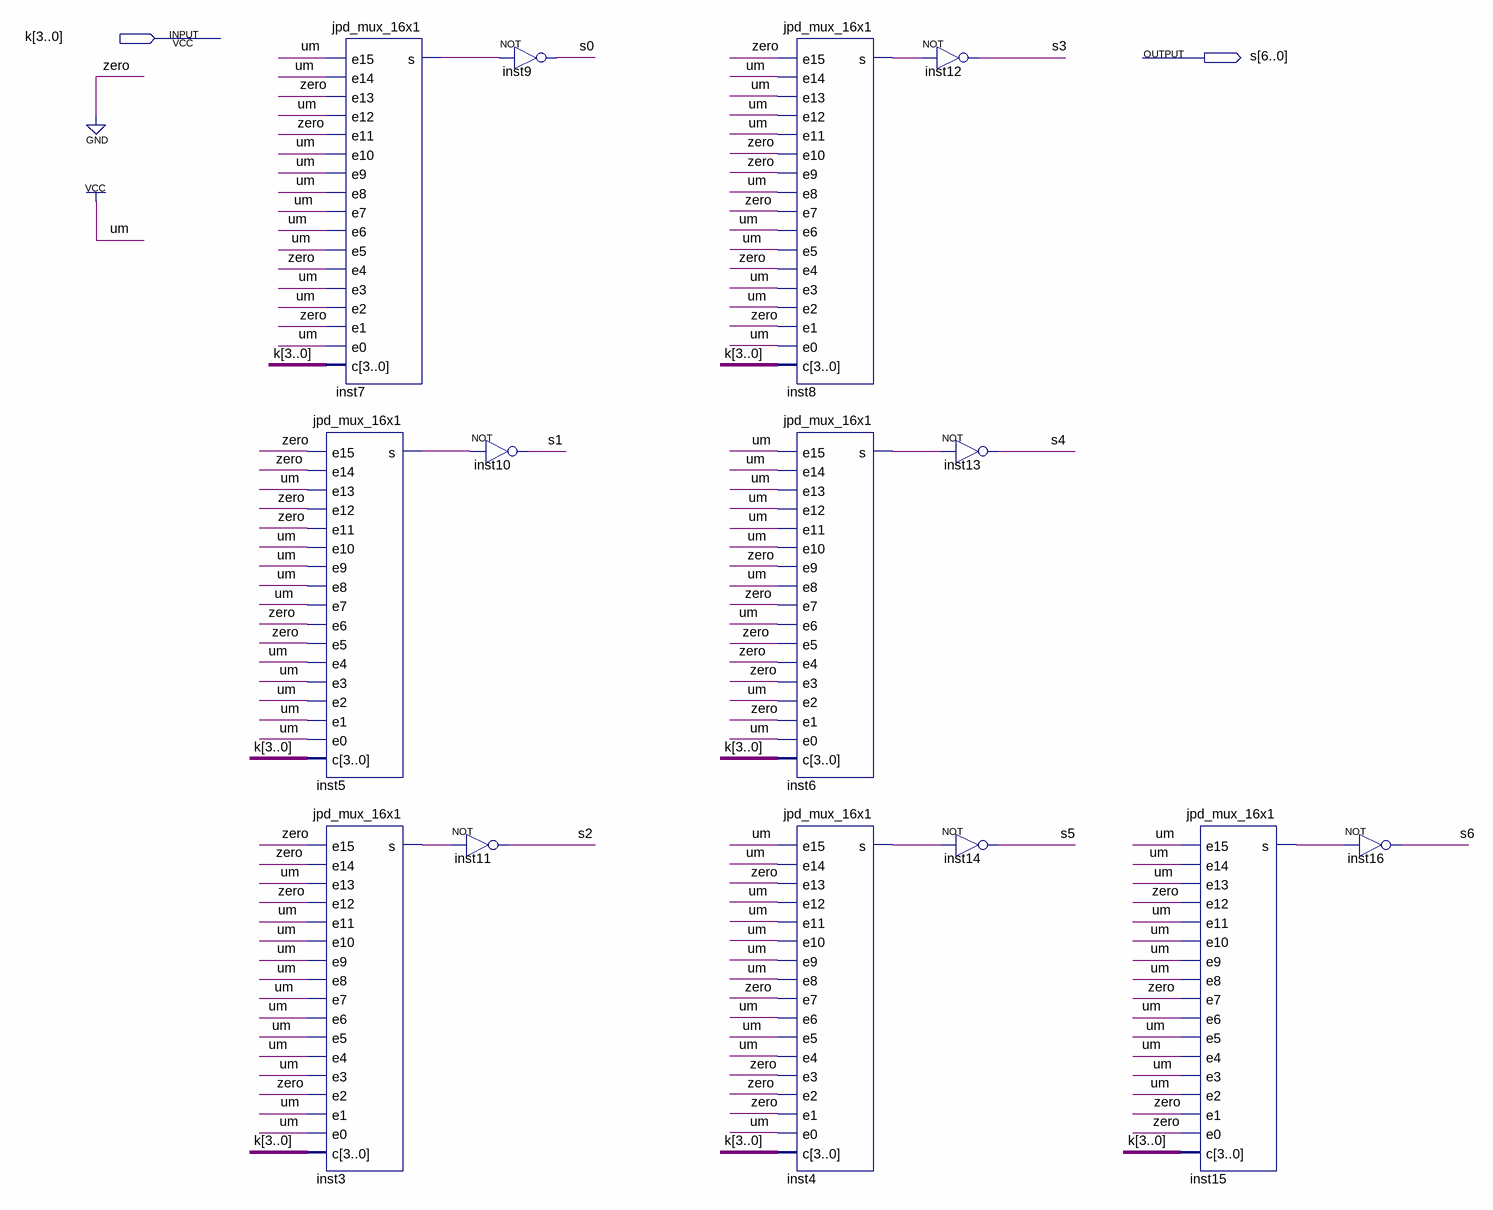
[diagram p0: schematic sheet]
// Quartus schematic jpd_display.bdf as structural Verilog: 14 symbols, 2 pins
module jpd_display (
  input  [3:0] k,
  output [6:0] s
);

  wire inst3_s, inst4_s, inst5_s, inst6_s, inst7_s, inst8_s, inst15_s;

  jpd_mux_16x1 inst7 (
    .e15(1'b1), .e14(1'b1), .e13(1'b0), .e12(1'b1), .e11(1'b0), .e10(1'b1), .e9(1'b1), .e8(1'b1), .e7(1'b1),
    .e6(1'b1), .e5(1'b1), .e4(1'b0), .e3(1'b1), .e2(1'b1), .e1(1'b0), .e0(1'b1), .c(k), .s(inst7_s));
  jpd_mux_16x1 inst5 (
    .e15(1'b0), .e14(1'b0), .e13(1'b1), .e12(1'b0), .e11(1'b0), .e10(1'b1), .e9(1'b1), .e8(1'b1), .e7(1'b1),
    .e6(1'b0), .e5(1'b0), .e4(1'b1), .e3(1'b1), .e2(1'b1), .e1(1'b1), .e0(1'b1), .c(k), .s(inst5_s));
  jpd_mux_16x1 inst3 (
    .e15(1'b0), .e14(1'b0), .e13(1'b1), .e12(1'b0), .e11(1'b1), .e10(1'b1), .e9(1'b1), .e8(1'b1), .e7(1'b1),
    .e6(1'b1), .e5(1'b1), .e4(1'b1), .e3(1'b1), .e2(1'b0), .e1(1'b1), .e0(1'b1), .c(k), .s(inst3_s));
  not inst10 (s[1], inst5_s);
  not inst11 (s[2], inst3_s);
  not inst9 (s[0], inst7_s);
  jpd_mux_16x1 inst8 (
    .e15(1'b0), .e14(1'b1), .e13(1'b1), .e12(1'b1), .e11(1'b1), .e10(1'b0), .e9(1'b0), .e8(1'b1), .e7(1'b0),
    .e6(1'b1), .e5(1'b1), .e4(1'b0), .e3(1'b1), .e2(1'b1), .e1(1'b0), .e0(1'b1), .c(k), .s(inst8_s));
  jpd_mux_16x1 inst6 (
    .e15(1'b1), .e14(1'b1), .e13(1'b1), .e12(1'b1), .e11(1'b1), .e10(1'b1), .e9(1'b0), .e8(1'b1), .e7(1'b0),
    .e6(1'b1), .e5(1'b0), .e4(1'b0), .e3(1'b0), .e2(1'b1), .e1(1'b0), .e0(1'b1), .c(k), .s(inst6_s));
  jpd_mux_16x1 inst4 (
    .e15(1'b1), .e14(1'b1), .e13(1'b0), .e12(1'b1), .e11(1'b1), .e10(1'b1), .e9(1'b1), .e8(1'b1), .e7(1'b0),
    .e6(1'b1), .e5(1'b1), .e4(1'b1), .e3(1'b0), .e2(1'b0), .e1(1'b0), .e0(1'b1), .c(k), .s(inst4_s));
  not inst12 (s[3], inst8_s);
  not inst13 (s[4], inst6_s);
  not inst14 (s[5], inst4_s);
  jpd_mux_16x1 inst15 (
    .e15(1'b1), .e14(1'b1), .e13(1'b1), .e12(1'b0), .e11(1'b1), .e10(1'b1), .e9(1'b1), .e8(1'b1), .e7(1'b0),
    .e6(1'b1), .e5(1'b1), .e4(1'b1), .e3(1'b1), .e2(1'b1), .e1(1'b0), .e0(1'b0), .c(k), .s(inst15_s));
  not inst16 (s[6], inst15_s);
endmodule
